# Altium schematic sheet CTR-Lower-Main-Board-Rev-C-Motor-2.SchDoc: CTR Controller - Motor
size B; Author: TWL; Organization: OLogic, Inc.; DocumentNumber: 112216; Revision: A; SheetNumber: 2; SheetTotal: 4; PageSetup: Record=PageOptions|CenterHorizontal=True|CenterVertical=True|PrintScale=0.70|XCorrection=1.00|YCorrection=1.00|PrintKind=0|BorderSize=5000000|LeftOffset=0|BottomOffset=0|Orientation=2|PaperLength=1000|PaperWidth=1000|Scale=100|PaperSource=15|PrintQuality=600|MediaType=1|DitherType=10|PrintScaleMode=1|PaperKind=Letter|PaperIndex=1
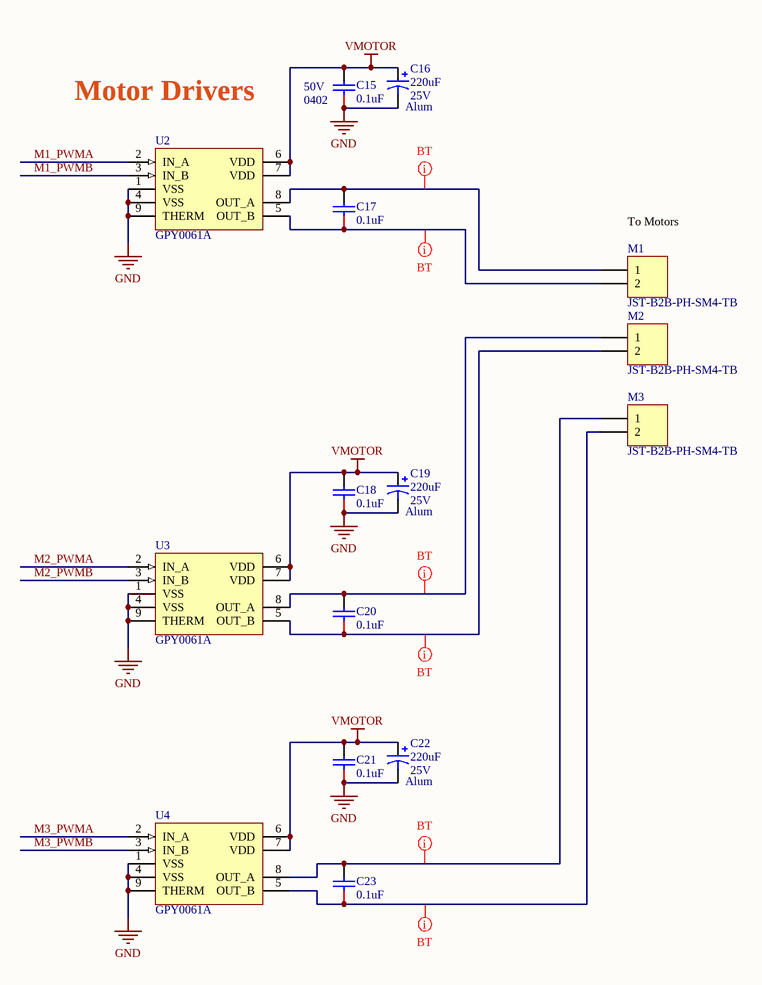
[diagram p0: CTR-Lower-Main-Board-Rev-C-Motor-2.SchDoc]

## Parts
C15  0.1uF  Voltage - Rated: 50V  Package / Case: 0402  [CAPC0402(1005)_N]
C16  220uF  Voltage Rating: 25V  Text: Alum  [Panasonic-F-Ecap]
C17  0.1uF  [CAPC0402(1005)_N]
C18  0.1uF  [CAPC0402(1005)_N]
C19  220uF  Voltage Rating: 25V  Text: Alum  [Panasonic-F-Ecap]
C20  0.1uF  [CAPC0402(1005)_N]
C21  0.1uF  [CAPC0402(1005)_N]
C22  220uF  Voltage Rating: 25V  Text: Alum  [Panasonic-F-Ecap]
C23  0.1uF  [CAPC0402(1005)_N]
M1  JST-B2B-PH-SM4-TB  [JST-B2B-PH-SM4-TB]
M2  JST-B2B-PH-SM4-TB  [JST-B2B-PH-SM4-TB]
M3  JST-B2B-PH-SM4-TB  [JST-B2B-PH-SM4-TB]
U2  GPY0061A  [SOG.050/8C-T]
U3  GPY0061A  [SOG.050/8C-T]
U4  GPY0061A  [SOG.050/8C-T]

## Nets
GND: C15.1 C16.2 C18.1 C19.2 C21.1 C22.2 M1.0 M2.0 M3.0 U2.1(VSS) U2.4(VSS) U2.9(THERM) U3.1(VSS) U3.4(VSS) U3.9(THERM) U4.1(VSS) U4.4(VSS) U4.9(THERM)
VMOTOR: C15.2 C16.1 C18.2 C19.1 C21.2 C22.1 U2.6(VDD) U2.7(VDD) U3.6(VDD) U3.7(VDD) U4.6(VDD) U4.7(VDD)
M1_PWMA: U2.2(IN_A)
M1_PWMB: U2.3(IN_B)
M2_PWMA: U3.2(IN_A)
M2_PWMB: U3.3(IN_B)
M3_PWMA: U4.2(IN_A)
M3_PWMB: U4.3(IN_B)
NetC17_1: C17.1 M1.2 U2.5(OUT_B)
NetC17_2: C17.2 M1.1 U2.8(OUT_A)
NetC20_1: C20.1 M2.2 U3.5(OUT_B)
NetC20_2: C20.2 M2.1 U3.8(OUT_A)
NetC23_1: C23.1 M3.2 U4.5(OUT_B)
NetC23_2: C23.2 M3.1 U4.8(OUT_A)

## Layout directives
net class BT: NetC17_1, NetC17_2, NetC20_1, NetC20_2, NetC23_1, NetC23_2

## Notes on the sheet
- Motor Drivers
- (near M1) To Motors
- Title
- By:
- Date:
- Number:
- Time:
- Revision:
- Sheet
- of
- OLogic, Inc.
- 1394 Borregas Ave.
- Sunnyvale, CA
- 94089 USA
- File:
- (650) 996-1490

## Library data of the parts
C15 C17 C18 C20 C21 C23 = CAP CER 0.1UF 50V 10% X7R 0402: 0.1uF 0402 50V; Manufacturer: TDK Corporation; Manufacturer Part Number: CGA2B3X7R1H104K050BB; Capacitance: 0.1µF; Tolerance: ±10%; Temperature Coefficient: X7R; Supplier 1: Digi-Key; RoHS: RoHS Compliant; Category: Capacitors; Stock 1: 1584397; Pricing 1: 1=0.16, 10=0.11, 100=0.0523, 250=0.044, 500=0.03686, 1000=0.03025, 5000=0.02558 (USD); Packaging: Cut Tape (CT); Mounting Type: Surface Mount, MLCC; Operating Temperature: -55°C ~ 125°C; Applications: Automotive; Ratings: AEC-Q200; Size / Dimension: 0.039" L x 0.020" W (1.00mm x 0.50mm); Height - Seated (Max): -; Thickness (Max): 0.022" (0.55mm); Lead Spacing: -; Features: -; Lead Style: -; ComponentLink1URL: http://product.tdk.com/en/catalog/datasheets/mlcc_automotive_general_en.pdf; ComponentLink1Description: http://product.tdk.com/en/catalog/datasheets/mlcc_automotive_general_en.pdf; Supplier Part Number 1: 445-6899-1-ND; Creator: osman
  C15: ClassName: motor1
  C17: Voltage - Rated: 50V; Package / Case: 0402 (1005 Metric); ClassName: motor1
  C18 C20: Voltage - Rated: 50V; Package / Case: 0402 (1005 Metric); ClassName: motor2
  C21 C23: Voltage - Rated: 50V; Package / Case: 0402 (1005 Metric); ClassName: motor3
C16 C19 C22 = CAP ALUM 220UF 25V 20% SMD: 220uF F-SM; Manufacturer: Panasonic; Manufacturer Part Number: EEE-1EA221UP; Vendor: Digikey; PN: EEE; Capacitance: 220µF; Tolerance: ±20%; Lifetime @ Temp.: 2000 Hrs @ 85°C; Ripple Current: 230mA; Surface Mount Land Size: 0.327" L x 0.327" W (8.30mm x 8.30mm); Supplier 1: Digi-Key; RoHS: RoHS Compliant; Category: Capacitors; Stock 1: 60437; Pricing 1: 1=0.81, 50=0.4872, 100=0.4263, 250=0.33496 (USD); Packaging: Cut Tape (CT); ESR (Equivalent Series Resistance): -; Operating Temperature: -40°C ~ 85°C; Type: -; Applications: General Purpose; Impedance: -; Lead Spacing: -; Size / Dimension: 0.315" Dia (8.00mm); Height - Seated (Max): 0.402" (10.20mm); Mounting Type: Surface Mount; Package / Case: Radial, Can - SMD; ComponentLink1URL: http://industrial.panasonic.com/www-cgi/jvcr13pz.cgi?E+PZ+3+ABA0002+EEE1EA221UP+7+WW; ComponentLink1Description: http://industrial.panasonic.com/www-cgi/jvcr13pz.cgi?E+PZ+3+ABA0002+EEE1EA221UP+7+WW; Supplier Part Number 1: PCE3902CT-ND
M1-M3 = JST-B2B-PH-SM4-TB: 2mm Locking Header, 2-Pin; Manufacturer: JST; MPN: B2B-PH-SM4-TB(LF)(SN); Vendor: Digikey; PN: 455-1734-1-ND; Connector Type: Header, Shrouded; Number of Positions: 2; Number of Positions Loaded: All; Pitch: 0.079" (2.00mm); Supplier 1: Digi-Key; Manufacturer Part Number: B2B-PH-SM4-TB(LF)(SN); RoHS: RoHS Compliant; Category: Connectors, Interconnects; Stock 1: 43142; Pricing 1: 1=0.51, 10=0.478, 50=0.3824, 100=0.3664, 250=0.33456, 500=0.31862 (USD); Packaging: Cut Tape (CT); Contact Type: Male Pin; Number of Rows: 1; Row Spacing: -; Contact Mating Length: -; Mounting Type: Surface Mount; Termination: Solder; Fastening Type: -; Features: Solder Retention; Contact Finish: Tin; Contact Finish Thickness: -; Color: Natural; ComponentLink1URL: http://www.jst-mfg.com/product/pdf/eng/ePH.pdf; ComponentLink1Description: http://www.jst-mfg.com/product/pdf/eng/ePH.pdf; Supplier Part Number 1: 455-1734-1-ND
U2 = GPY0061A: 2A Motor Driver; Manufacturer: GeneralPlus; Supplier 1: Spectrum Rep.; Manufacturer Part Number: GPY0061A; Supplier Part Number 1: GPY0061A; ClassName: motor1
U3 U4 = GPY0061A: 2A Motor Driver; Manufacturer: GeneralPlus; Vendor: Spectrum Rep.; MPN: GPY0061A; PN: GPY0061A; Manufacturer Part Number: GPY0061A; Supplier 1: Spectrum Rep.; Supplier Part Number 1: GPY0061A
  U3: ClassName: motor2
  U4: ClassName: motor3